# EAGLE design PowerReg (EAGLE 8.6.3)
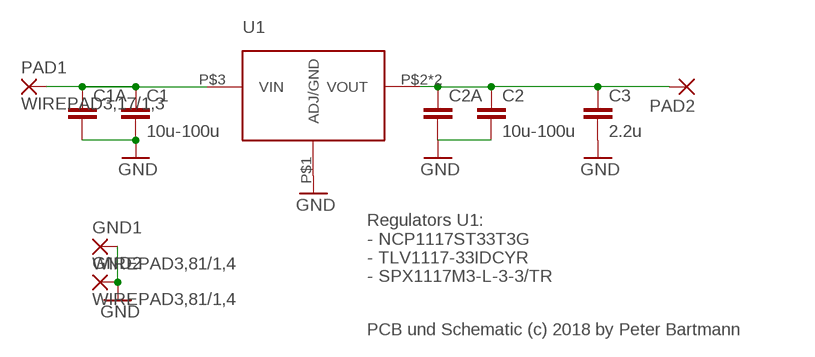
[diagram p0: schematic, sheet 1]

## Parts
C1  10u-100u  C-EUC0805  [C0805]
C1A  C-EUC1210K  [C1210K]
C2  10u-100u  C-EUC0805  [C0805]
C2A  C-EUC1210K  [C1210K]
C3  2.2u  C-EUC0603  [C0603]
GND1  WIREPAD3,81/1,4  [3,81/1,4]
GND2  WIREPAD3,81/1,4  [3,81/1,4]
PAD1  WIREPAD3,17/1,3  [3,17/1,3]
PAD2  SMD5  [SMD2,54-5,08]
U1  SPX1117  [SOT-223]

## Nets
GND: C1.2 C1A.2 C2.2 C2A.2 C3.2 GND1.1(P) GND2.1(P) U1.P$1(ADJ/GND)
N$1: C1.1 C1A.1 PAD1.1(P) U1.P$3(VIN)
N$2: C2.1 C2A.1 C3.1 PAD2.1(P) U1.P$2(VOUT) U1.P$4(VOUT)

## Notes on the sheet
- Regulators U1:
  - NCP1117ST33T3G
  - TLV1117-33IDCYR
  - SPX1117M3-L-3-3/TR
- PCB und Schematic (c) 2018 by Peter Bartmann

## Library data of the parts
C1 C2 = rcl:C-EU: CAPACITOR, European symbol; SPICEPREFIX: C
C1A C2A C3 = rcl:C-EU: CAPACITOR, European symbol
GND1 GND2 PAD1 = wirepad:WIREPAD: Wire PAD connect wire on PCB
PAD2 = wirepad:SMD5: SMD PAD
U1 = SPX1117:SPX1117

## Board
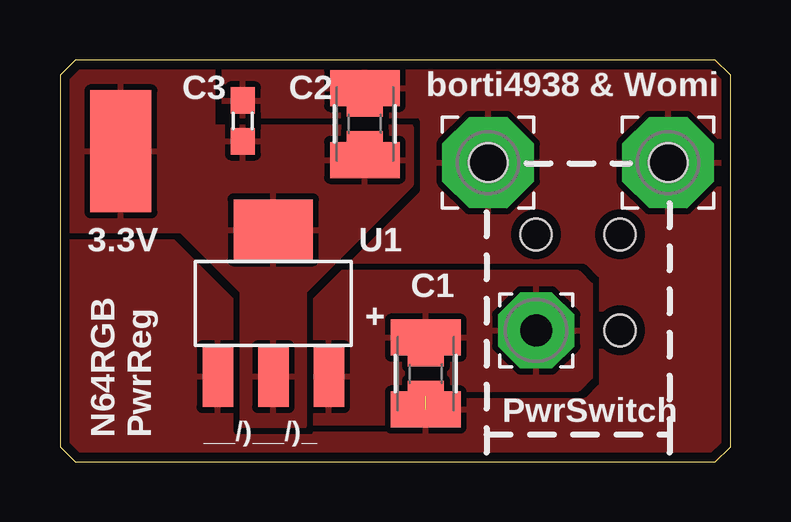
[diagram p1: board, top side]

Size 27.94 x 16.76 mm. Coordinates in mm from the lower left corner, seen from the top.
Outline: 27.3,0 27.94,0.64 27.94,16.13 27.3,16.76 0.64,16.76 0,16.13 0,0.64 0.64,0 27.3,0
Copper layers (1*16): Top 0.0356mm / dielectric 1.5011mm / Bottom 0.0356mm
Design rules "LaenPCBOrder *": minimum track width 6mil, minimum drill 13mil, track to track 10mil, track to pad 10mil, pad to pad 10mil, via to via 10mil, smd to smd 10mil, copper to edge 15mil, drill to drill 6mil, minimum pad ring 7mil, minimum via ring 7mil, stop-mask expansion 3mil, vias tented up to drill 30mil, thermal gap 10mil
Holes 1.3 mm at 19.84,9.48 23.34,9.48 23.34,5.48
Holes 1.6 mm at 17.84,12.48 25.34,12.48
tRestrict: 2 lines

### Footprints (pad centres in the part's own frame; a part is rotated, then mirrored left to right if it is on the bottom)
C0805 = smd 1.3 x 1.5: 1 -0.95,0; 2 0.95,0
C1210K = smd 1.5 x 2.9: 1 -1.5,0; 2 1.5,0
C0603 = smd 1.1 x 1: 1 -0.85,0; 2 0.85,0
3,81/1,4 = drill 1.397 pad 3.81 octagon: 1 0,0
3,17/1,3 = drill 1.321 pad 3.175 octagon: 1 0,0
SMD2,54-5,08 = smd 2.54 x 5.08: 1 0,0
SOT-223 = smd 1.27 x 2.54: P$1 -2.311,-3.048; P$2 0,-3.048; P$3 2.311,-3.048 | smd 3.302 x 2.54: P$4 0,3.073

### Placement (x,y rotation side)
C1  15.24,3.68 270 top
C1A  15.24,3.68 270 top
C2  12.7,14.1 90 top
C2A  12.7,14.1 90 top
C3  7.62,14.22 90 top
GND1  17.84,12.48 0 top
GND2  25.34,12.48 0 top
PAD1  19.84,5.48 0 top
PAD2  2.54,12.95 180 top
U1  8.89,6.6 0 top

### Tracks (layer width: path | path; a pad name or v marks a point on that pad's centre or on a via)
GND  (1 unrouted)
  pour Top (rank 6): 27.94,-1.02 27.94,18.03 0,18.03 0,-1.02
N$1
  pour Top (rank 5): 21.59,7.87 10.92,7.87 10.16,7.11 10.16,1.65 13.84,1.65 13.84,3.05 21.59,3.05 22.1,3.56 22.1,7.37
N$2
  pour Top: 0,18.03 6.35,18.03 6.35,13.97 14.61,13.97 14.61,11.56 10.16,7.11 10.16,1.52 7.62,1.52 7.62,7.11 5.08,9.65 0,9.65

### Text on the board
tNames: C3 | C2 | borti4938 & Womi | 3.3V | U1 | C1 | + | PwrSwitch | N64RGB / PwrReg | __/)__/)_
bNames: U1: / / C1: / / C2: / / C3: | NCP1117ST33T3G / (SOT223) / 10-100uF/16V+ / (SMD0805-1210) / 10-100uF/6.3V+ / (SMD0805-1210) / 2.2uF / 6.3V+ / (SMD0603)
tDocu: PCB und Schematic / (c) 2018 by Peter Bartmann